# Altium schematic sheet Soldeer Station.SchDoc
size B; SheetNumber: 1; SheetTotal: 5
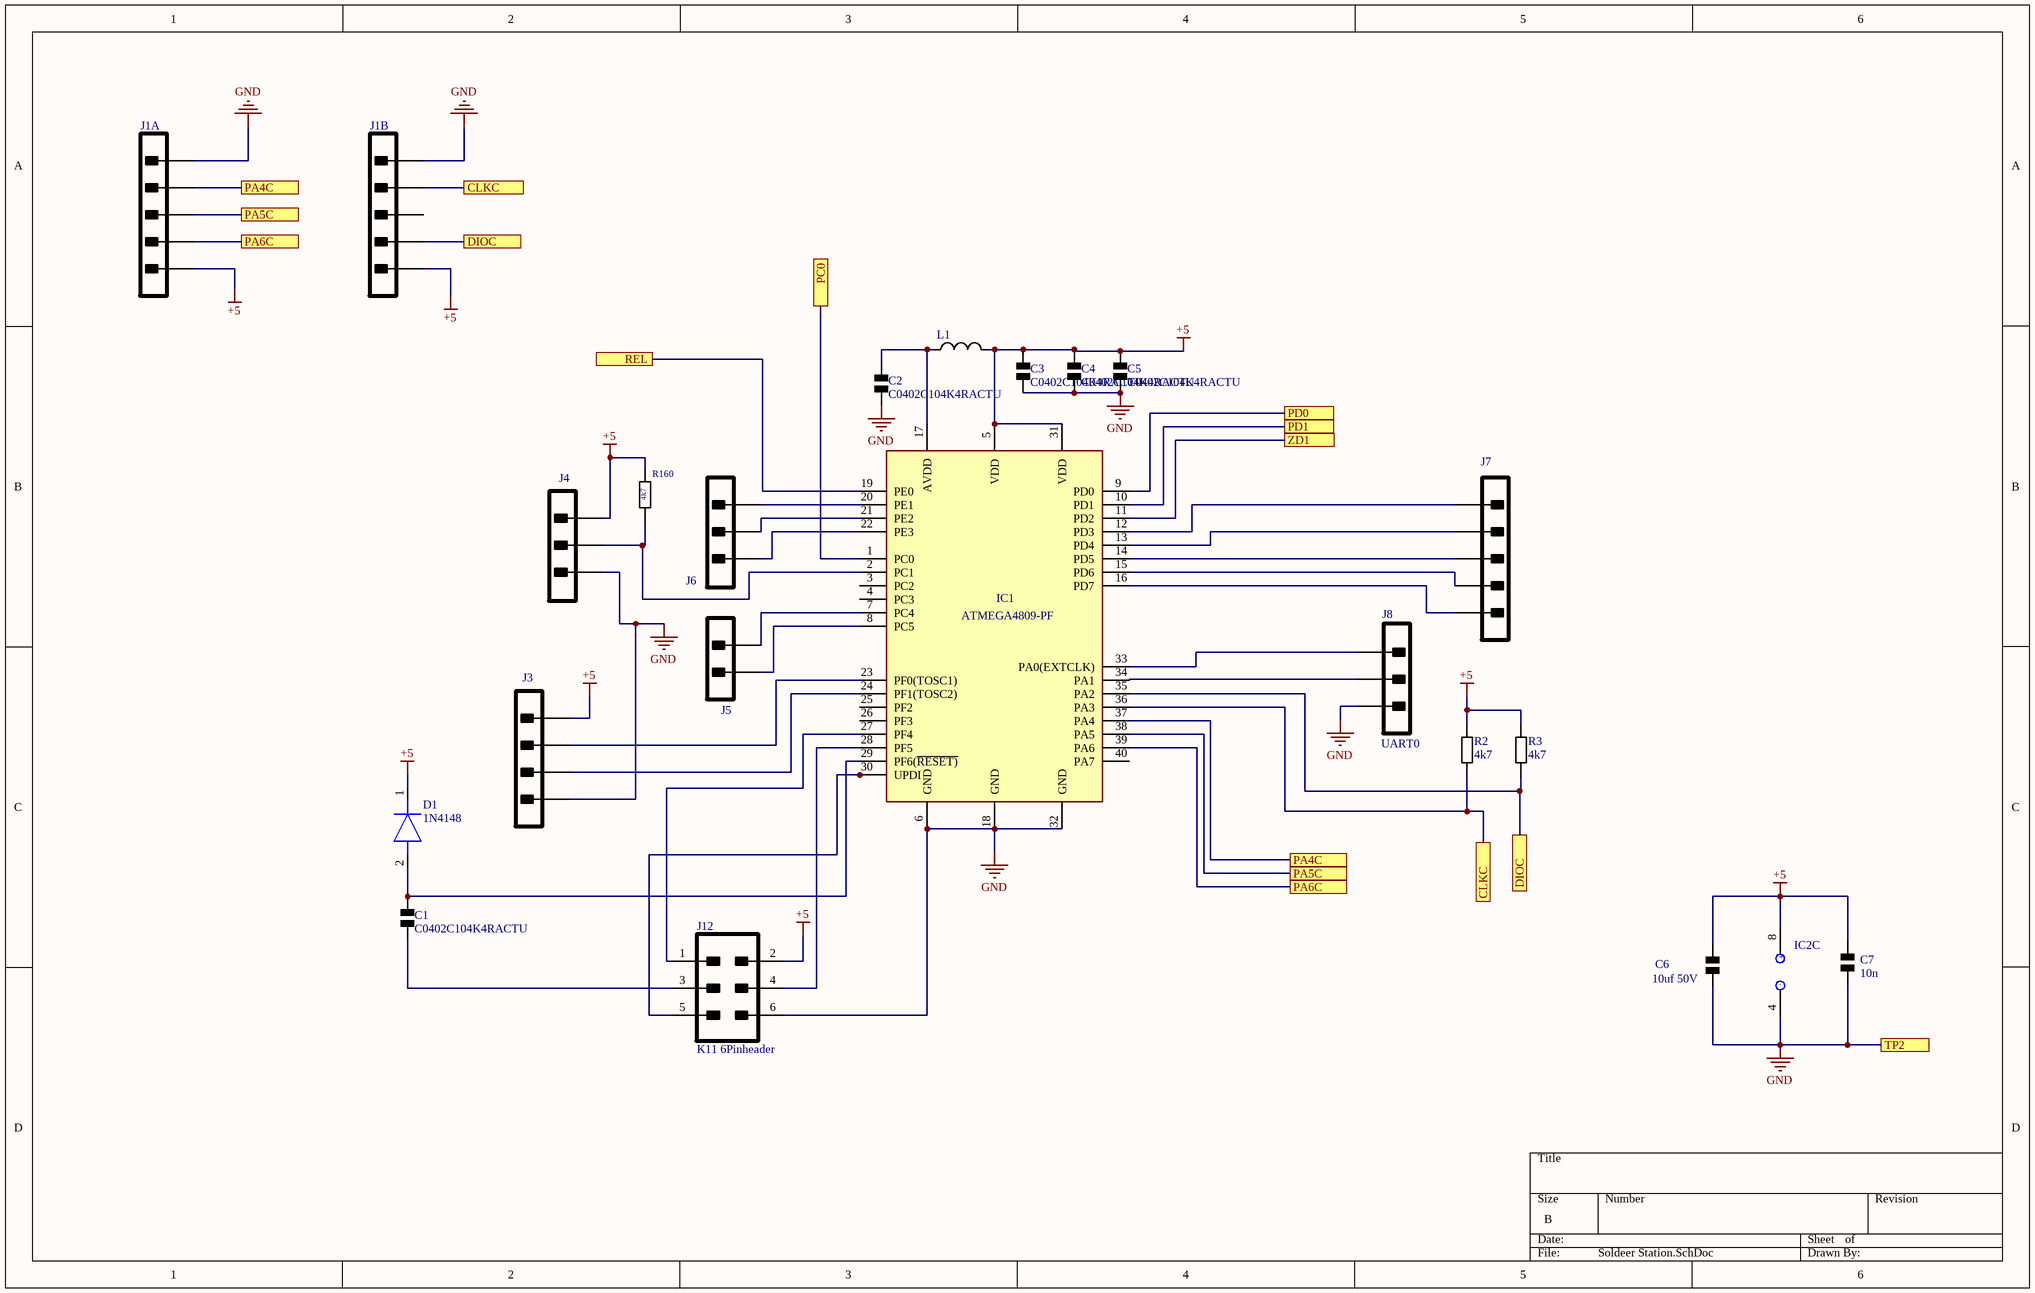
[diagram p0: Soldeer Station.SchDoc]

## Parts
C1  C0402C104K4RACTU  [Capacitor]
C2  C0402C104K4RACTU  [Capacitor]
C3  C0402C104K4RACTU  [Capacitor]
C4  C0402C104K4RACTU  [Capacitor]
C5  C0402C104K4RACTU  [Capacitor]
C6  10uf 50V  [Capacitor]
C7  10n  [Capacitor]
D1  1N4148  [1N4007]
IC1  ATMEGA4809-PF  [ATmega4809-PF]
IC2  MCP6002-E/P  [MCP6002]  (value not drawn)  (part C of 3)
J1A  K9 5Pinheader  [K9 5Pinheader]  (value not drawn)
J1B  K9 5Pinheader  [K9 5Pinheader]  (value not drawn)
J3  UART2  [K6 4Pinheader]  (value not drawn)
J4  K4,7,10 3Pinheader  [K4,7,10 3Pinheader]  (value not drawn)
J5  K5 2Pinheader  [K5 2Pinheader]  (value not drawn)
J6  (no value)  [K4,7,10 3Pinheader]
J7  K9 5Pinheader  [K9 5Pinheader]  (value not drawn)
J8  UART0  [K4,7,10 3Pinheader]
J12  K11 6Pinheader  [K11 6Pinheader]
L1  (no value)  [Smoorspoel]
R2  4k7  [Resistor]
R3  4k7  [Resistor]
R160  4k7  [Resistor]

## Ports
CLKC (see Soldeer Station[2A]), CLKC (see Soldeer Station[5C]), DIOC (see Soldeer Station[2A]), DIOC (see Soldeer Station[5C]), PA4C (see Soldeer Station[1A]), PA4C (see Soldeer Station[4C]), PA5C (see Soldeer Station[1A]), PA5C (see Soldeer Station[4C]), PA6C (see Soldeer Station[1A]), PA6C (see Soldeer Station[4C]), PC0 (see Verwarmingselement[1C]), PD0 (see Tempmeting[1B]), PD1 (see Tempmeting[1C]), REL (see Batterij[2B]), TP2, ZD1 (see Batterij[4C])

## Nets
+5: C3.2 C4.1 C5.1 C6.2 C7.2 D1.1(K) IC1.5(VDD) IC1.31(VDD) IC2.8(VINA-) J1A.5 J1B.5 J3.1 J4.1 J12.2 L1.2 R2.2 R3.2 R160.2
GND: C2.1 C3.1 C4.2 C5.2 C6.1 C7.1 IC1.6(GND) IC1.18(GND) IC1.32(GND) IC2.4(VINA+) J1A.1 J1B.1 J3.4 J4.3 J8.1 J12.6 ; port TP2
CLKC: IC1.36(PA3) J1B.2 R2.1 ; port CLKC
DIOC: IC1.35(PA2) J1B.4 R3.1 ; port DIOC
PA4C: IC1.37(PA4) J1A.2 ; port PA4C
PA5C: IC1.38(PA5) J1A.3 ; port PA5C
PA6C: IC1.39(PA6) J1A.4 ; port PA6C
PC0: IC1.1(PC0) ; port PC0
PD0: IC1.9(PD0) ; port PD0
PD1: IC1.10(PD1) ; port PD1
REL: IC1.19(PE0) ; port REL
ZD1: IC1.11(PD2) ; port ZD1
NetC1_1: C1.1 J12.3
NetC1_2: C1.2 D1.2(A) IC1.29(PF6(~{RESET)})
NetC2_2: C2.2 IC1.17(AVDD) L1.1
NetIC1_2: IC1.2(PC1) J4.2 R160.1
NetIC1_7: IC1.7(PC4) J5.1
NetIC1_8: IC1.8(PC5) J5.2
NetIC1_12: IC1.12(PD3) J7.5
NetIC1_13: IC1.13(PD4) J7.4
NetIC1_14: IC1.14(PD5) J7.3
NetIC1_15: IC1.15(PD6) J7.2
NetIC1_16: IC1.16(PD7) J7.1
NetIC1_20: IC1.20(PE1) J6.1
NetIC1_21: IC1.21(PE2) J6.2
NetIC1_22: IC1.22(PE3) J6.3
NetIC1_23: IC1.23(PF0(TOSC1)) J3.2
NetIC1_24: IC1.24(PF1(TOSC2)) J3.3
NetIC1_27: IC1.27(PF4) J12.1
NetIC1_28: IC1.28(PF5) J12.4
NetIC1_30: IC1.30(UPDI) J12.5
NetIC1_33: IC1.33(PA0(EXTCLK)) J8.3
NetIC1_34: IC1.34(PA1) J8.2

Not connected (* = marked no-connect by the designer): IC1 3(PC2) 4(PC3) 25(PF2) 26(PF3) 40(PA7); J1B 3

## Notes on the sheet
- (in symbol MCP6002, part C) +; -

## Library data of the parts
C1-C5 = Condensator: Manufacturer: Kemet; Part Number: C0402C104K4RACTU
C6 C7 = Condensator: Manufacturer: Kemet; Part Number: C0402C104K4RACTU
D1 = 1N4148,133: Diode; Manufacturer_Name: Nexperia; Datasheet Link: https://assets.nexperia.com/documents/data-sheet/1N4148_1N4448.pdf; Manufacturer_Part_Number: 1N4148,133; Mouser Part Number: 771-1N4148,133; Mouser Price/Stock: https://www.mouser.co.uk/ProductDetail/Nexperia/1N4148133?qs=elmhQ6eFu7hy8ApvpFxPZg%3D%3D; Arrow Part Number: 1N4148,133; Arrow Price/Stock: https://www.arrow.com/en/products/1n4148133/nxp-semiconductors
IC2 = MCP6002: None; Slew Rate: 0.6V/µs; Supply Current: 100uA; Power Supply Rejection Ratio (PSRR): 86dB; Input Offset Voltage (Vos): 4.5mV; Input Bias Current: 1pA; Amplifier Type: GENERAL PURPOSE; Unity Gain Bandwidth Product: 1MHz; Number of Circuits: 2; Output Current: 23mA; Operating Supply Voltage: 5.5V; Min Supply Voltage: 1.8V; Common Mode Rejection Ratio: 60dB; Voltage Gain: 112dB; Max Supply Voltage: 6V; Package Quantity: 60; REACH SVHC: No SVHC; Min Operating Temperature: -40°C; Max Operating Temperature: 125°C; Mount: Through Hole; Nominal Supply Current: 100uA; Height: 3.3mm; Length: 9.27mm; Slew Rate-Nom: 0.6V/µs; Packaging: Rail/Tube; Output Current per Channel: 23mA; Number of Amplifiers: 2; RoHS Compliant: Yes; Radiation Hardening: No; Bandwidth: 1MHz; Lead Free: Lead Free; Width: 6.35mm; Number of Channels: 2; Gain Bandwidth Product: 1MHz; Technology: CMOS; Operating Supply Current: 100uA; Number of Elements: 2; Number of Pins: 8; Input Offset Voltage-Max: 4.5mV; Case/Package: PDIP
J1A J1B J7 = K9 5Pinheader: NexarPartId: 278173; Voltage Rating: 250V; Number of Contacts: 5; Contact Resistance: 20mΩ; Gender: Male; Pitch: 2.54mm; Connector Type: Male Pin; Current Rating: 4A; Glow Wire Compliant: Non-compliant; Max Voltage Rating (DC): 250.25kV; Flammability Rating: UL94 V-0; Min Operating Temperature: 0°C; REACH SVHC: Unknown; Lead Free: Lead Free; Termination: Solder; RoHS: Compliant; Schedule B: 8536694040|8536694040|8536694040|8536694040|8536694040|8536694040|8536694040|8536694040|8536694040|8536694040|8536694040|8536694040|8536694040|8536694040|8536694040|8536694040|8536694040|8536694040|8536694040|8536694040|8536694040|8536694040|8536694040|85; Number of Circuits: 5; Mount: Through Hole; Lead Pitch: 2.54mm; Height: 2.29mm; Voltage Rating (DC): 250V; Max Operating Temperature: 75°C; Width: 2.49mm; Radiation Hardening: No; Contact Plating: Tin; Orientation: Vertical; Length: 12.7mm; Number of Rows: 1; Housing Material: Thermoplastic; Contact Material: Brass; Packaging: Bulk; Contact Mating Length: 6.096mm; Housing Color: Black; Color: Black; Number of Positions: 5
J3 = K6 4Pinheader: NexarPartId: 278173; Voltage Rating: 250V; Number of Contacts: 5; Contact Resistance: 20mΩ; Gender: Male; Pitch: 2.54mm; Connector Type: Male Pin; Current Rating: 4A; Glow Wire Compliant: Non-compliant; Max Voltage Rating (DC): 250.25kV; Flammability Rating: UL94 V-0; Min Operating Temperature: 0°C; REACH SVHC: Unknown; Lead Free: Lead Free; Termination: Solder; RoHS: Compliant; Schedule B: 8536694040|8536694040|8536694040|8536694040|8536694040|8536694040|8536694040|8536694040|8536694040|8536694040|8536694040|8536694040|8536694040|8536694040|8536694040|8536694040|8536694040|8536694040|8536694040|8536694040|8536694040|8536694040|8536694040|85; Number of Circuits: 5; Mount: Through Hole; Lead Pitch: 2.54mm; Height: 2.29mm; Voltage Rating (DC): 250V; Max Operating Temperature: 75°C; Width: 2.49mm; Radiation Hardening: No; Contact Plating: Tin; Orientation: Vertical; Length: 12.7mm; Number of Rows: 1; Housing Material: Thermoplastic; Contact Material: Brass; Packaging: Bulk; Contact Mating Length: 6.096mm; Housing Color: Black; Color: Black; Number of Positions: 5
J4 J6 J8 = K4,7,10 3Pinheader: NexarPartId: 278173; Voltage Rating: 250V; Number of Contacts: 5; Contact Resistance: 20mΩ; Gender: Male; Pitch: 2.54mm; Connector Type: Male Pin; Current Rating: 4A; Glow Wire Compliant: Non-compliant; Max Voltage Rating (DC): 250.25kV; Flammability Rating: UL94 V-0; Min Operating Temperature: 0°C; REACH SVHC: Unknown; Lead Free: Lead Free; Termination: Solder; RoHS: Compliant; Schedule B: 8536694040|8536694040|8536694040|8536694040|8536694040|8536694040|8536694040|8536694040|8536694040|8536694040|8536694040|8536694040|8536694040|8536694040|8536694040|8536694040|8536694040|8536694040|8536694040|8536694040|8536694040|8536694040|8536694040|85; Number of Circuits: 5; Mount: Through Hole; Lead Pitch: 2.54mm; Height: 2.29mm; Voltage Rating (DC): 250V; Max Operating Temperature: 75°C; Width: 2.49mm; Radiation Hardening: No; Contact Plating: Tin; Orientation: Vertical; Length: 12.7mm; Number of Rows: 1; Housing Material: Thermoplastic; Contact Material: Brass; Packaging: Bulk; Contact Mating Length: 6.096mm; Housing Color: Black; Color: Black; Number of Positions: 5
J5 = K5 2Pinheader: NexarPartId: 278173; Voltage Rating: 250V; Number of Contacts: 5; Contact Resistance: 20mΩ; Gender: Male; Pitch: 2.54mm; Connector Type: Male Pin; Current Rating: 4A; Glow Wire Compliant: Non-compliant; Max Voltage Rating (DC): 250.25kV; Flammability Rating: UL94 V-0; Min Operating Temperature: 0°C; REACH SVHC: Unknown; Lead Free: Lead Free; Termination: Solder; RoHS: Compliant; Schedule B: 8536694040|8536694040|8536694040|8536694040|8536694040|8536694040|8536694040|8536694040|8536694040|8536694040|8536694040|8536694040|8536694040|8536694040|8536694040|8536694040|8536694040|8536694040|8536694040|8536694040|8536694040|8536694040|8536694040|85; Number of Circuits: 5; Mount: Through Hole; Lead Pitch: 2.54mm; Height: 2.29mm; Voltage Rating (DC): 250V; Max Operating Temperature: 75°C; Width: 2.49mm; Radiation Hardening: No; Contact Plating: Tin; Orientation: Vertical; Length: 12.7mm; Number of Rows: 1; Housing Material: Thermoplastic; Contact Material: Brass; Packaging: Bulk; Contact Mating Length: 6.096mm; Housing Color: Black; Color: Black; Number of Positions: 5
J12 = K11 6Pinheader: NexarPartId: 278173; Voltage Rating: 250V; Number of Contacts: 5; Contact Resistance: 20mΩ; Gender: Male; Pitch: 2.54mm; Connector Type: Male Pin; Current Rating: 4A; Glow Wire Compliant: Non-compliant; Max Voltage Rating (DC): 250.25kV; Flammability Rating: UL94 V-0; Min Operating Temperature: 0°C; REACH SVHC: Unknown; Lead Free: Lead Free; Termination: Solder; RoHS: Compliant; Schedule B: 8536694040|8536694040|8536694040|8536694040|8536694040|8536694040|8536694040|8536694040|8536694040|8536694040|8536694040|8536694040|8536694040|8536694040|8536694040|8536694040|8536694040|8536694040|8536694040|8536694040|8536694040|8536694040|8536694040|85; Number of Circuits: 5; Mount: Through Hole; Lead Pitch: 2.54mm; Height: 2.29mm; Voltage Rating (DC): 250V; Max Operating Temperature: 75°C; Width: 2.49mm; Radiation Hardening: No; Contact Plating: Tin; Orientation: Vertical; Length: 12.7mm; Number of Rows: 1; Housing Material: Thermoplastic; Contact Material: Brass; Packaging: Bulk; Contact Mating Length: 6.096mm; Housing Color: Black; Color: Black; Number of Positions: 5
L1 = Smoorspoel 10 µH: Test Frequency: 1MHz; Max DC Current: 1.6A; Inductance Tolerance: 20%; Core Material: Ferrite; Self Resonant Frequency: 20MHz; DC Resistance (DCR): 36mR; Inductance: 10uH; Shielding: Shielded; Radiation Hardening: No; Height: 4.7mm; Lead Free: Lead Free; Current Rating: 1.6A; Length: 0.248inch; REACH SVHC: No SVHC; Military Standard: Not; Max Operating Temperature: 80°C; Packaging: Tape and Reel; Height - Seated (Max): 0.197inch; Depth: 6.6mm; Width: 6.3mm; Package Quantity: 350; Case Code (Metric): 6363; Resistor Type: Wirewound; DC Current: 1.6A; Weight: 0.025045oz; Case/Package: 2525; Termination: SMD/SMT; Min Operating Temperature: -25°C; Tolerance: 20%; Case Code (Imperial): 2525; Mount: Surface Mount
R2 R3 R160 = Resistor: Manufacturer: Vishay Dale; Part Number: CRCW08050000Z0EA
IC1 = ATMEGA4809-PF: RoHS Compliant: Yes